# EAGLE design RP2040_Thing_Plus (EAGLE 9.4.2)
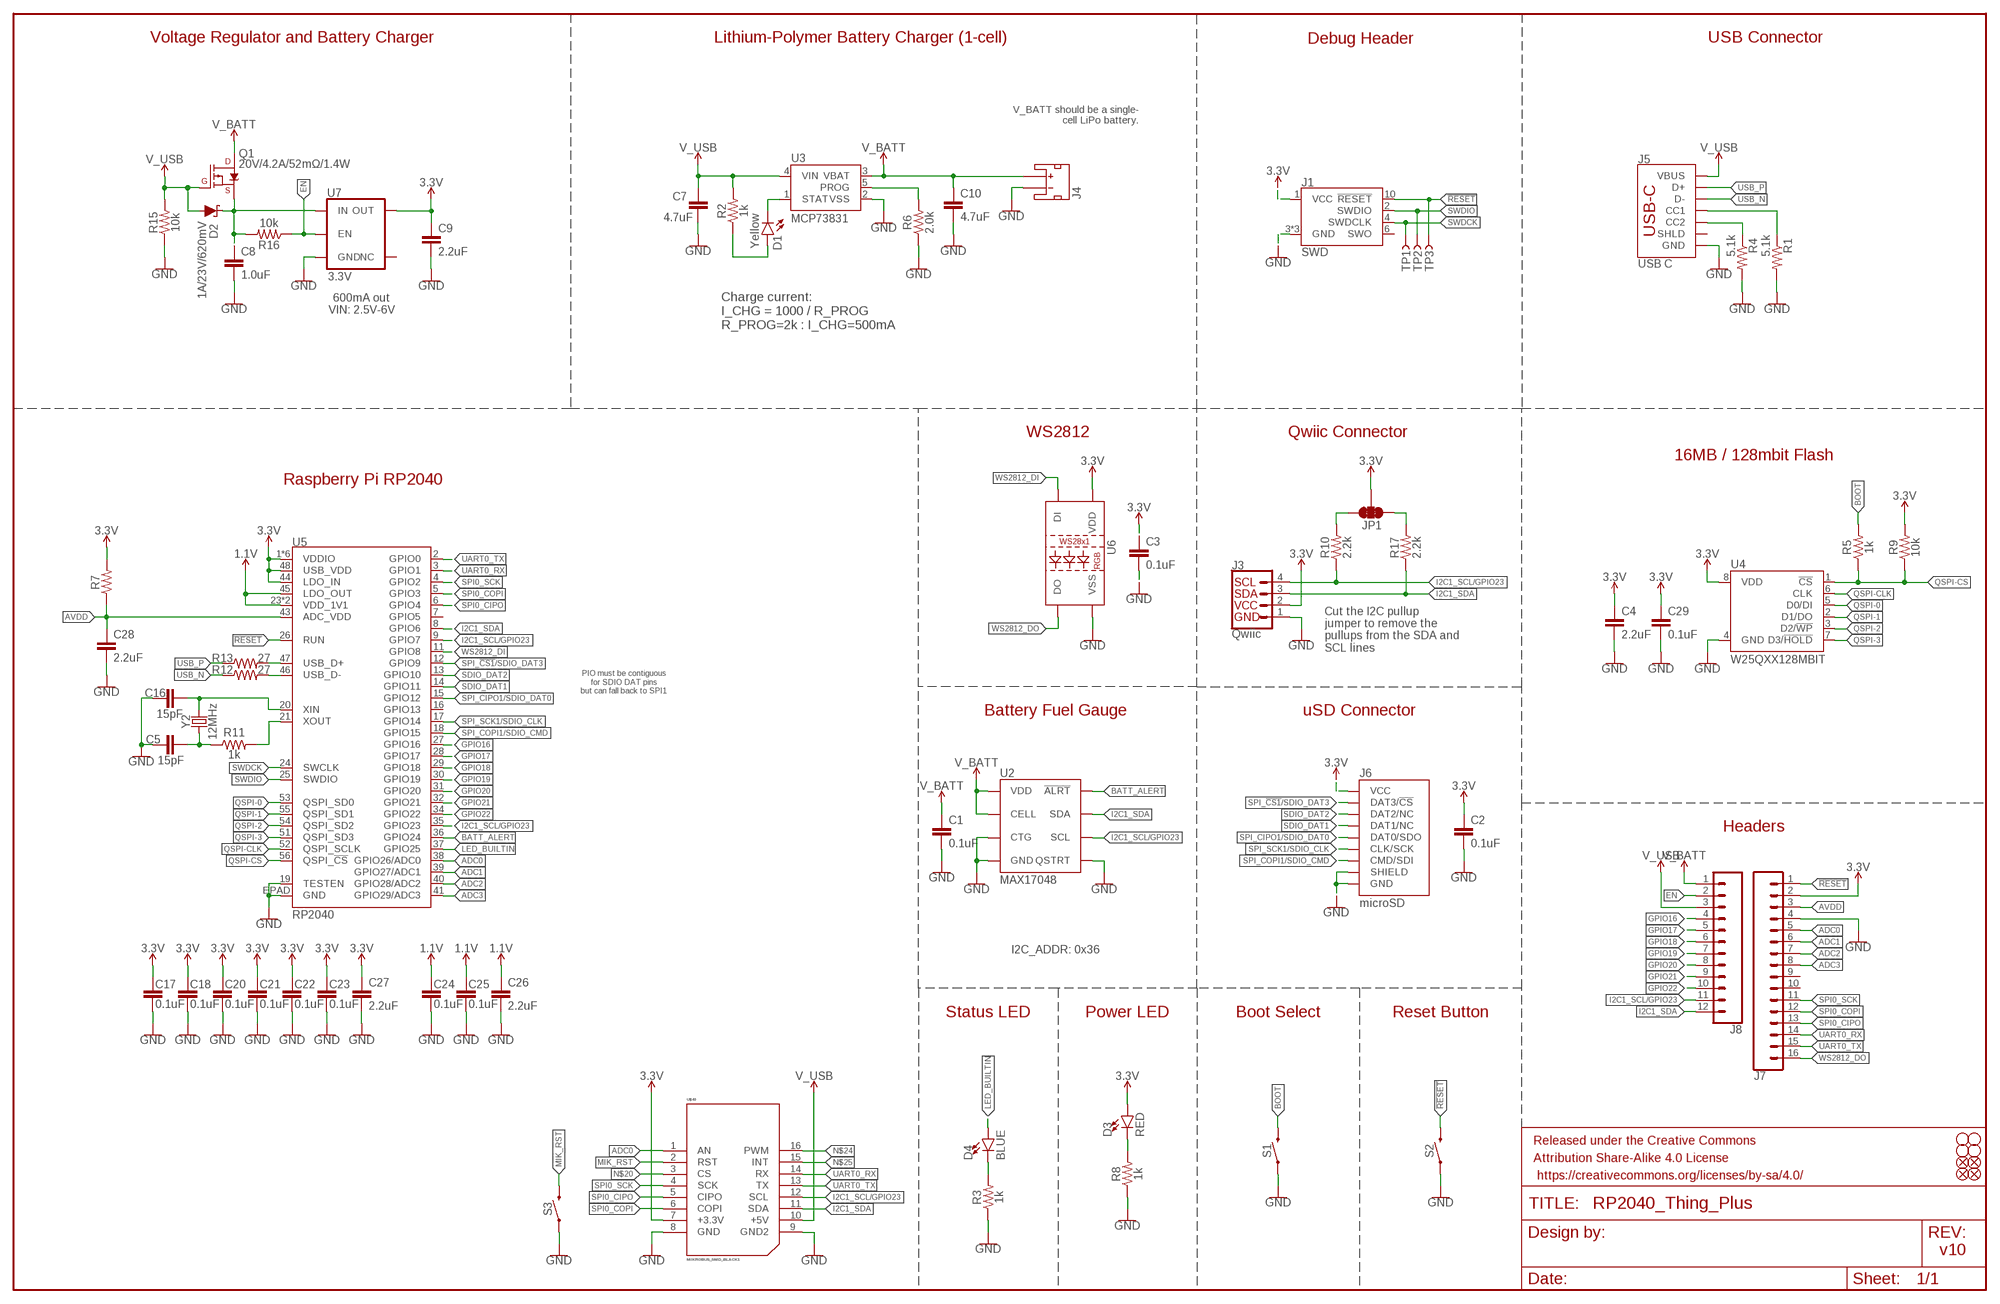
[diagram p0: schematic, sheet 1]

## Parts
C1  0.1uF  0.1UF-0402T-6.3V-10%-X7R  [0402-TIGHT]
C2  0.1uF  0.1UF-0402T-6.3V-10%-X7R  [0402-TIGHT]
C3  0.1uF  0.1UF-0402T-6.3V-10%-X7R  [0402-TIGHT]
C4  2.2uF  2.2UF-0402_TIGHT-10V-10%-X5R  [0402-TIGHT]
C5  15pF  15PF-0402T-50V-5%  [0402-TIGHT]
C7  4.7uF  4.7UF-0402_TIGHT-6.3V-20%-X5R  [0402-TIGHT]
C8  1.0uF  1.0UF-0402T-16V-10%  [0402-TIGHT]
C9  2.2uF  2.2UF-0402_TIGHT-10V-10%-X5R  [0402-TIGHT]
C10  4.7uF  4.7UF-0402_TIGHT-6.3V-20%-X5R  [0402-TIGHT]
C16  15pF  15PF-0402T-50V-5%  [0402-TIGHT]
C17  0.1uF  0.1UF-0402T-6.3V-10%-X7R  [0402-TIGHT]
C18  0.1uF  0.1UF-0402T-6.3V-10%-X7R  [0402-TIGHT]
C20  0.1uF  0.1UF-0402T-6.3V-10%-X7R  [0402-TIGHT]
C21  0.1uF  0.1UF-0402T-6.3V-10%-X7R  [0402-TIGHT]
C22  0.1uF  0.1UF-0402T-6.3V-10%-X7R  [0402-TIGHT]
C23  0.1uF  0.1UF-0402T-6.3V-10%-X7R  [0402-TIGHT]
C24  0.1uF  0.1UF-0402T-6.3V-10%-X7R  [0402-TIGHT]
C25  0.1uF  0.1UF-0402T-6.3V-10%-X7R  [0402-TIGHT]
C26  2.2uF  2.2UF-0402_TIGHT-10V-10%-X5R  [0402-TIGHT]
C27  2.2uF  2.2UF-0402_TIGHT-10V-10%-X5R  [0402-TIGHT]
C28  2.2uF  2.2UF-0402_TIGHT-10V-10%-X5R  [0402-TIGHT]
C29  0.1uF  0.1UF-0402T-6.3V-10%-X7R  [0402-TIGHT]
D1  Yellow  LED-YELLOW0603  [LED-0603]
D2  1A/23V/620mV  DIODE-SCHOTTKY-BAT20J  [SOD-323]
D3  RED  LED-RED0603  [LED-0603]
D4  BLUE  LED-BLUE0603  [LED-0603]
FD1  FIDUCIALUFIDUCIAL  [FIDUCIAL-MICRO]
FD2  FIDUCIALUFIDUCIAL  [FIDUCIAL-MICRO]
FD3  FIDUCIALUFIDUCIAL  [FIDUCIAL-MICRO]
FD4  FIDUCIALUFIDUCIAL  [FIDUCIAL-MICRO]
FRAME1  FRAME-LEDGER  [CREATIVE_COMMONS]
H1  STAND-OFF  [STAND-OFF]
H2  STAND-OFF  [STAND-OFF]
H3  STAND-OFF  [STAND-OFF]
H4  STAND-OFF  [STAND-OFF]
J1  SWD  CORTEX_JTAG_DEBUG_MINIMUM_PTH  [2X5-PTH-1.27MM]
J3  Qwiic  QWIIC_CONNECTORJS-1MM  [JST04_1MM_RA]
J4  JST_2MM_MALE  [JST-2-SMD]
J5  USB C  USB_C_4-LAYER-ISOLATED  [USB-C-16P-4LAYER-ISOLATED]
J6  microSD  MICRO-SD-SDIOPUSH-PUSH  [MICRO-SD-SOCKET]
J7  CONN_161X16_NO_SILK  [1X16_NO_SILK]
J8  CONN_12NO_SILK  [1X12_NO_SILK]
JP1  JUMPER-SMT_3_2-NC_TRACE_SILK  [SMT-JUMPER_3_2-NC_TRACE_SILK]
Q1  20V/4.2A/52mΩ/1.4W  MOSFET_PCH-DMG2305UX-7  [SOT23-3]
R1  5.1k  5.1KOHM-0402T-1/16W-1%  [0402-TIGHT]
R2  1k  1KOHM-0402T-1/16W-1%  [0402-TIGHT]
R3  1k  1KOHM-0402T-1/16W-1%  [0402-TIGHT]
R4  5.1k  5.1KOHM-0402T-1/16W-1%  [0402-TIGHT]
R5  1k  1KOHM-0402T-1/16W-1%  [0402-TIGHT]
R6  2.0k  2.0KOHM-0603-1/10W-5%  [0603]
R7  200OHM-0402T-1/16W-1%  [0402-TIGHT]
R8  1k  1KOHM-0402T-1/16W-1%  [0402-TIGHT]
R9  10k  10KOHM-0402T-1/16W-1%  [0402-TIGHT]
R10  2.2k  2.2KOHM-0402T-1/16W-1%  [0402-TIGHT]
R11  1k  1KOHM-0402T-1/16W-1%  [0402-TIGHT]
R12  27  27OHM  [0402-TIGHT]
R13  27  27OHM  [0402-TIGHT]
R15  10k  10KOHM-0402T-1/16W-1%  [0402-TIGHT]
R16  10k  10KOHM-0402T-1/16W-1%  [0402-TIGHT]
R17  2.2k  2.2KOHM-0402T-1/16W-1%  [0402-TIGHT]
S1  MOMENTARY-SWITCH-SPST-SMD-5.2MM-TALL  [TACTILE_SWITCH_SMD_5.2MM]
S2  MOMENTARY-SWITCH-SPST-SMD-5.2MM-TALL  [TACTILE_SWITCH_SMD_5.2MM]
S3  MOMENTARY-SWITCH-SPST-SMD-5.2MM-TALL  [TACTILE_SWITCH_SMD_5.2MM]
TP1  TEST-POINT3X4  [PAD.03X.04]
TP2  TEST-POINT3X4  [PAD.03X.04]
TP3  TEST-POINT3X4  [PAD.03X.04]
U2  MAX17048  MAX17048DFN8  [DFN-8]
U3  MCP73831  [SOT23-5]
U4  W25QXX128MBIT  W25QXX128MBIT-6X5-SKINNY_CENTER  [WSON-8-6X5-SKINNY_CENTERPAD]
U5  RP2040  [QFN-56]
U6  WS2812-2020  [WS2812-2020]
U7  3.3V  V_REG_AP2112K-3.3V  [SOT23-5]
U$43  MIKROBUS_SMD_BLACK1  [MIKROBUS_SMD_BLACK]
Y2  12MHz  CRYSTAL-12MHZ  [CRYSTAL-SMD-2X2.5MM]

## Nets
1.1V: C24.1 C25.1 C26.1 U5.23(VDD_1V1) U5.45(LDO_OUT) U5.50(VDD_1V1)
3.3V: C2.1 C3.1 C4.1 C9.1 C17.1 C18.1 C20.1 C21.1 C22.1 C23.1 C27.1 C29.1 D3.A J1.1(VCC) J3.2 J6.VCC J7.2 JP1.2 R7.2 R9.2 U4.8(VDD) U5.1(VDDIO) U5.10(VDDIO) U5.22(VDDIO) U5.33(VDDIO) U5.42(VDDIO) U5.44(LDO_IN) U5.48(USB_VDD) U5.49(VDDIO) U6.4(VDD) U7.5(OUT) U$43.7(+3.3V)
!RESET!: J1.10(!RESET) J7.1 S2.3 TP3.P$1 U5.26(RUN)
ADC0: J7.5 U5.38(GPIO26/ADC0) U$43.1(AN)
ADC1: J7.6 U5.39(GPIO27/ADC1)
ADC2: J7.7 U5.40(GPIO28/ADC2)
ADC3: J7.8 U5.41(GPIO29/ADC3)
AVDD: C28.1 J7.3 R7.1 U5.43(ADC_VDD)
BATT_ALERT: U2.5(!ALRT) U5.36(GPIO24)
BOOT: R5.2 S1.3
EN: J8.2 R16.1 U7.3(EN)
GND: C1.2 C2.2 C3.2 C4.2 C5.1 C7.2 C8.2 C9.2 C10.2 C16.1 C17.2 C18.2 C20.2 C21.2 C22.2 C23.2 C24.2 C25.2 C26.2 C27.2 C28.2 C29.2 J1.3(GND) J1.5(GND) J1.9(GND) J3.1 J4.1(-) J5.GND J5.GND2(GND) J6.CD1(SHIELD) J6.GND J6.GND1(GND) J6.GND3(GND) J7.4 R1.2 R3.1 R4.2 R6.1 R8.1 R15.1 S1.1 S2.1 S3.1 U2.1(CTG) U2.4(GND) U2.6(QSTRT) U2.9(GND) U3.2(VSS) U4.4(GND) U5.19(TESTEN) U5.EPAD(GND) U6.2(VSS) U7.2(GND) U$43.8(GND) U$43.9(GND2)
GPIO16: J8.4 U5.27(GPIO16)
GPIO17: J8.5 U5.28(GPIO17)
GPIO18: J8.6 U5.29(GPIO18)
GPIO19: J8.7 U5.30(GPIO19)
GPIO20: J8.8 U5.31(GPIO20)
GPIO21: J8.9 U5.32(GPIO21)
GPIO22: J8.10 U5.34(GPIO22)
I2C1_SCL/GPIO23: J3.4 J8.11 R10.1 U2.7(SCL) U5.9(GPIO7) U5.35(GPIO23) U$43.12(SCL)
I2C1_SDA: J3.3 J8.12 R17.1 U2.8(SDA) U5.8(GPIO6) U$43.11(SDA)
LED_BUILTIN: D4.A U5.37(GPIO25)
MIK_RST: S3.3 U$43.2(RST)
N$1: D4.C R3.2
N$2: JP1.3 R10.2
N$3: JP1.1 R17.2
N$4: R11.2 U5.21(XOUT)
N$5: C16.2 U5.20(XIN) Y2.P3
N$6: C5.2 R11.1 Y2.P1
N$7: D3.C R8.2
N$9: D1.C U3.1(STAT)
N$11: J5.A5(CC1) R1.1
N$12: J5.B5(CC2) R4.1
N$14: R6.2 U3.5(PROG)
N$15: C8.1 D2.C Q1.2(S) R16.2 U7.1(IN)
N$17: D1.A R2.1
N$20: U$43.3(CS)
N$24: U$43.16(PWM)
N$25: U$43.15(INT)
QSPI-0: U4.5(D0/DI) U5.53(QSPI_SD0)
QSPI-1: U4.2(D1/DO) U5.55(QSPI_SD1)
QSPI-2: U4.3(D2/!WP!) U5.54(QSPI_SD2)
QSPI-3: U4.7(D3/!HOLD!) U5.51(QSPI_SD3)
QSPI-CLK [Clock]: U4.6(CLK) U5.52(QSPI_SCLK)
QSPI-CS: R5.1 R9.1 U4.1(!CS!) U5.56(QSPI_!CS!)
SDIO_DAT1: J6.DAT1(DAT1/NC) U5.14(GPIO11)
SDIO_DAT2: J6.DAT2(DAT2/NC) U5.13(GPIO10)
SPI0_CIPO: J7.13 U5.6(GPIO4) U$43.5(CIPO)
SPI0_COPI: J7.12 U5.5(GPIO3) U$43.6(COPI)
SPI0_SCK: J7.11 U5.4(GPIO2) U$43.4(SCK)
SPI_!CS1!/SDIO_DAT3: J6.CS/DAT3(DAT3/!CS!) U5.12(GPIO9)
SPI_CIPO1/SDIO_DAT0: J6.DO/DAT0(DAT0/SDO) U5.15(GPIO12)
SPI_COPI1/SDIO_CMD: J6.DI/CMD(CMD/SDI) U5.18(GPIO15)
SPI_SCK1/SDIO_CLK: J6.SCLK(CLK/SCK) U5.17(GPIO14)
SWDCK: J1.4(SWDCLK) TP1.P$1 U5.24(SWCLK)
SWDIO: J1.2(SWDIO) TP2.P$1 U5.25(SWDIO)
UART0_RX: J7.14 U5.3(GPIO1) U$43.14(RX)
UART0_TX: J7.15 U5.2(GPIO0) U$43.13(TX)
USB_F_N: R12.2 U5.46(USB_D-)
USB_F_P: R13.2 U5.47(USB_D+)
USB_N: J5.A7(D-) J5.B7(D-) R12.1
USB_P: J5.A6(D+) J5.B6(D+) R13.1
V_BATT: C1.1 C10.1 J4.2(+) J8.1 Q1.3(D) U2.2(CELL) U2.3(VDD) U3.3(VBAT)
V_USB: C7.1 D2.A J5.VBUS1(VBUS) J5.VBUS2(VBUS) J8.3 Q1.1(G) R2.2 R15.2 U3.4(VIN) U$43.10(+5V)
WS2812_DI: U5.11(GPIO8) U6.3(DI)
WS2812_DO: J7.16 U6.1(DO)
Unconnected: J1.6(SWO) J4.NC1(PAD1) J4.NC2(PAD2) J5.SHLD1(SHLD) J5.SHLD2(SHLD) J5.SHLD3(SHLD) J5.SHLD4(SHLD) J5.SHLD5(SHLD) J5.SHLD6(SHLD) J5.SHLD7(SHLD) J5.SHLD8(SHLD) J7.9 J7.10 U5.7(GPIO5) U5.16(GPIO13) U7.4(NC)

## Notes on the sheet
- Voltage Regulator and Battery Charger | Lithium-Polymer Battery Charger (1-cell) | Debug Header | USB Connector
- V_BATT should be a single-
  cell LiPo battery.
- Charge current:
  I_CHG = 1000 / R_PROG
  R_PROG=2k : I_CHG=500mA
- 600mA out
  VIN: 2.5V-6V
- WS2812 | Qwiic Connector
- 16MB / 128mbit Flash
- Raspberry Pi RP2040
- Cut the I2C pullup 
  jumper to remove the 
  pullups from the SDA and 
  SCL lines
- PIO must be contiguous
  for SDIO DAT pins
  but can fall back to SPI1
- Battery Fuel Gauge | uSD Connector
- Headers
- I2C_ADDR: 0x36
- Status LED | Power LED | Boot Select | Reset Button
- v10

## Library data of the parts
C1-C3 C17 C18 C20-C25 C29 = SparkFun-Capacitors:0.1UF: 0.1µF ceramic capacitors A capacitor is a passive two-terminal electrical component used to store electrical energy temporarily in an electric field.; PROD_ID: CAP-14993
C4 C9 C26-C28 = SparkFun-Capacitors:2.2UF: 2.2µF ceramic capacitors A capacitor is a passive two-terminal electrical component used to store electrical energy temporarily in an electric field.; PROD_ID: CAP-14232
C5 C16 = SparkFun-Capacitors:15PF: 15pF ceramic capacitors A capacitor is a passive two-terminal electrical component used to store electrical energy temporarily in an electric field.; PROD_ID: CAP-13063
C7 C10 = SparkFun-Capacitors:4.7UF: 4.7µF ceramic capacitors A capacitor is a passive two-terminal electrical component used to store electrical energy temporarily in an electric field.; PROD_ID: CAP-14240
C8 = SparkFun-Capacitors:1.0UF: 1µF ceramic capacitors A capacitor is a passive two-terminal electrical component used to store electrical energy temporarily in an electric field.; PROD_ID: CAP-12417
D1 = SparkFun-LED:LED-YELLOW: Yellow SMD LED Used in manufacturing several products at SparkFun. Packages: 0603 - SMD 0603 package[Product Link] <http://www.kingbrightusa.com/product.asp?catalog_name=LED&product_id=APT1608SYCK> 0603 -SMART - SMART SMD 0603 package (more efficient/more expensive) [Product Link] <http://www.osram-os.com/osram_os/en/products/product-catalog/led-light-emitting-diodes/smartled-0603/ly-l29k/index.jsp> LilyPad - SMD1206 package[Product Datasheet] <https://www.sparkfun.com/datasheets/DevTools/LilyPad/Q150YUS4.pdf> SparkFun Products: Blynk Board <https://www.sparkfun.com/products/13794> IOIO-OTG <https://www.sparkfun.com/products/13613> XBee Explorer Serial <https://www.sparkfun.com/products/13225>; PROD_ID: DIO-09003
D2 = SparkFun-DiscreteSemi:DIODE-SCHOTTKY: Schottky diode A Schottky diode is a semiconductor diode which has a low forward voltage drop and a very fast switching action.; PROD_ID: DIO-11623
D3 = SparkFun-LED:LED-RED: Red SMD LED Used in manufacturing of most products at SparkFun Packages: 0603 - SMD 0603 package [Product Link] <http://docs.avagotech.com/docs/AV02-0551EN> 0603 SMART - SMD 0603 SMART package ( more efficient and expensive)[Product Link] <http://www.osram-os.com/Graphics/XPic2/00077099_0.pdf> 1206 - SMD1206 package [Product Link] <https://www.sparkfun.com/datasheets/DevTools/LilyPad/Q150OVS4.pdff> SparkFun Products: Pro Mini 328 -5V <https://www.sparkfun.com/products/821> RedBoard <https://www.sparkfun.com/products/12757> IOIO-OTG <https://www.sparkfun.com/products/13613>; PROD_ID: DIO-00819
D4 = SparkFun-LED:LED-BLUE: Blue SMD LED Used in manufacturing of various products at SparkFun Packages: 0603 - SMD 0603 package [Product Link] <http://www.digikey.com/product-detail/en/SMLE12BC7TT86/511-1589-2-ND/1641808> 1206 - SMD1206 package [Product Link] <http://www.digikey.com/product-detail/en/lite-on-inc/LTST-C150TBKT/160-1643-1-ND/573584> SparkFun Products: ESP8266 Thing-Dev Board <https://www.sparkfun.com/products/13711> RedBoard <https://www.sparkfun.com/products/12757>; PROD_ID: DIO-08575
FD1-FD4 = SparkFun-Aesthetics:FIDUCIAL: Fiducial Alignment Points Point-of-reference for pick-and-place machines and other optical instruments.
FRAME1 = SparkFun-Aesthetics:FRAME-LEDGER: Schematic Frame - Ledger Standard 11x14 US Ledger frame
H1-H4 = SparkFun-Hardware:STAND-OFF: Stand Off Drill holes for mechanically mounting via screws, standoffs, etc. Note: Use the keepout ring to avoid running the screw head into surrounding components. Variant Overviews STAND-OFF - Mechanical footprint for a #4 phillips button head screw. STAND-OFF-TIGHT - Mechanical footprint for a #4 phillips button head screw, Example SparkFun Products Screw - Phillips Head (1/4", 4-40, 10 pack) <https://www.sparkfun.com/products/10453> (PRT-10453) Screw - Phillips Head (1/2", 4-40, 10 pack) <https://www.sparkfun.com/products/10452> (PRT-10452) Screw - Phillips Head (3/4", 4-40, 10 pack) <https://www.sparkfun.com/products/10451> (PRT-10451) Screw - Phillips Head (1", 4-40, 10 pack) <https://www.sparkfun.com/products/10450> (PRT-10450)
J1 = SparkFun-Connectors:CORTEX_JTAG_DEBUG_MINIMUM: Cortex Debug Connector - 10 pin Supports JTAG debug, Serial Wire debug, and Serial Wire Viewer. PTH and SMD connector options available. General Connector Information <http://infocenter.arm.com/help/topic/com.arm.doc.faqs/attached/13634/cortex_debug_connectors.pdf> Products: PTH Connector <http://www.digikey.com/product-detail/en/cnc-tech/3220-10-0100-00/1175-1627-ND/3883661> -via Digi-Key SparkFun PSoc <https://www.sparkfun.com/products/13229> SparkFun T <https://www.sparkfun.com/products/13810>
J3 = SparkFun-Connectors:QWIIC_CONNECTOR: SparkFun I2C Standard Qwiic Connector An SMD 1mm pitch JST connector makes it easy and quick (get it? Qwiic?) to connect I2C devices to each other. The Qwiic system <http://www.sparkfun.com/qwiic> enables fast and solderless connection between popular platforms and various sensors and actuators. We carry 200mm <https://www.sparkfun.com/products/14204>, 100mm <https://www.sparkfun.com/products/14205>, 50mm <https://www.sparkfun.com/products/14206>, and breadboard friendly <https://www.sparkfun.com/products/14207> Qwiic cables. We also offer 10 pcs strips <https://www.sparkfun.com/products/14323> the SMD connectors.; PROD_ID: CONN-13694; VALUE: QWIIC_RIGHT_ANGLE
J4 = SparkFun-Connectors:JST_2MM_MALE: JST 2MM MALE RA CONNECTOR Two pin, compact surface mount connector. Commonly used as a battery input connection point. We really like the solid locking feeling and high current rating on these small connectors. We use these all the time as battery connectors. Mates to single-cell LiPo batteries. Here is the connector we sell at SparkFun: JST Right Angle Connector - White <https://www.sparkfun.com/products/8612> (PRT-08612) Datasheet <http://www.sparkfun.com/datasheets/Prototyping/Connectors/JST-Horizontal.pdf> It was used on these SparkFun products: SparkFun MOSFET Power Controller <https://www.sparkfun.com/products/11214> (PRT-11214) SparkFun Battery Babysitter - LiPo Battery Manager <https://www.sparkfun.com/products/13777> (PRT-13777) And many, many others that required a lipo battery connection.; PROD_ID: CONN-11443; SF_ID: PRT-08612
J5 = SparkFun-Connectors:USB_C: USB Type C 16Pin Connector Super Speed pins not available on the 16-pin purely SMD connector so this part is best for USB 2.0 implementations. D1 and D2 are tied together enabling D+/- no matter which way the cable is plugged into the connector. The two channel configuration pins (CC1/2) are exposed. These are normally connected to ground via 5.1k resistors but can be reconfigured for high current/high power applications. **4-LAYER BOARD WARNING!!** If designing 4-layer board, make sure to select the variant _4-LAYER-ISOLATED. The linked footprint (USB-C-16-4LAYER-ISOLATED) includes some very necessary cutout polygons in the inner layers (2 and 15). This prevents the PTH mounting shield legs on the USB connector from electrically connecting any other polygons on the inner layers (usually VCC and GND).; PROD_ID: CONN-14122; VALUE: USB Female Type C Connector
J6 = SparkFun-Connectors:MICRO-SD-SDIO: microSD Socket for Transflash Push-push type µSD socket. tDoc lines correctly indicate media card edge positions when inserting (unlocked, locked, depressed). NOTE: CD1 and CD2 are connected internally, and the default detect state of the socket is detect pin to ground. SparkFun Products: WAV Trigger <https://www.sparkfun.com/products/13660> CAN-Bus Shield <https://www.sparkfun.com/products/13262> SparkFun Level Shifing microSD Breakout <https://www.sparkfun.com/products/13743>; PROD_ID: CONN-07820
J7 = SparkFun-Connectors:CONN_16: Multi connection point. Often used as Generic Header-pin footprint for 0.1 inch spaced/style header connections On any of the 0.1 inch spaced packages, you can populate with these: Break Away Headers - Straight <https://www.sparkfun.com/products/116> (PRT-00116) Break Away Male Headers - Right Angle <https://www.sparkfun.com/products/553> (PRT-00553) Female Headers <https://www.sparkfun.com/products/115> (PRT-00115) Break Away Headers - Machine Pin <https://www.sparkfun.com/products/117> (PRT-00117) Break Away Female Headers - Swiss Machine Pin <https://www.sparkfun.com/products/743> (PRT-00743) For SCREWTERMINALS and SPRING TERMINALS visit here: Screw Terimnals on SparkFun.com <https://www.sparkfun.com/search/results?term=Screw+Terminals> (5mm/3.5mm/2.54mm spacing) This device is also useful as a general connection point to wire up your design to another part of your project. Our various solder wires solder well into these plated through hole pads. Hook-Up Wire - Assortment (Stranded, 22 AWG) <https://www.sparkfun.com/products/11375> (PRT-11375) Hook-Up Wire - Assortment (Solid Core, 22 AWG) <https://www.sparkfun.com/products/11367> (PRT-11367) View the entire wire category on our website here <https://www.sparkfun.com/categories/141> Special notes: Molex polarized connector foot print use with SKU : PRT-08231 with associated crimp pins and housings. 1MM SMD Version SKU: PRT-10208 NOTES ON THE VARIANTS LOCK and LOCK_LONGPADS... This footprint was designed to help hold the alignment of a through-hole component (i.e. 6-pin header) while soldering it into place. You may notice that each hole has been shifted either up or down by 0.005 of an inch from it's more standard position (which is a perfectly straight line). This slight alteration caused the pins (the squares in the middle) to touch the edges of the holes. Because they are alternating, it causes a "brace" to hold the component in place. 0.005 has proven to be the perfect amount of "off-center" position when using our standard breakaway headers. Although looks a little odd when you look at the bare footprint, once you have a header in there, the alteration is very hard to notice. Also,if you push a header all the way into place, it is covered up entirely on the bottom side.
J8 = SparkFun-Connectors:CONN_12: Multi connection point. Often used as Generic Header-pin footprint for 0.1 inch spaced/style header connections On any of the 0.1 inch spaced packages, you can populate with these: Break Away Headers - Straight <https://www.sparkfun.com/products/116> (PRT-00116) Break Away Male Headers - Right Angle <https://www.sparkfun.com/products/553> (PRT-00553) Female Headers <https://www.sparkfun.com/products/115> (PRT-00115) Break Away Headers - Machine Pin <https://www.sparkfun.com/products/117> (PRT-00117) Break Away Female Headers - Swiss Machine Pin <https://www.sparkfun.com/products/743> (PRT-00743) For SCREWTERMINALS and SPRING TERMINALS visit here: Screw Terimnals on SparkFun.com <https://www.sparkfun.com/search/results?term=Screw+Terminals> (5mm/3.5mm/2.54mm spacing) This device is also useful as a general connection point to wire up your design to another part of your project. Our various solder wires solder well into these plated through hole pads. Hook-Up Wire - Assortment (Stranded, 22 AWG) <https://www.sparkfun.com/products/11375> (PRT-11375) Hook-Up Wire - Assortment (Solid Core, 22 AWG) <https://www.sparkfun.com/products/11367> (PRT-11367) View the entire wire category on our website here <https://www.sparkfun.com/categories/141> Special notes: Molex polarized connector foot print use with SKU : PRT-08231 with associated crimp pins and housings. 1MM SMD Version SKU: PRT-10208 NOTES ON THE VARIANTS LOCK and LOCK_LONGPADS... This footprint was designed to help hold the alignment of a through-hole component (i.e. 6-pin header) while soldering it into place. You may notice that each hole has been shifted either up or down by 0.005 of an inch from it's more standard position (which is a perfectly straight line). This slight alteration caused the pins (the squares in the middle) to touch the edges of the holes. Because they are alternating, it causes a "brace" to hold the component in place. 0.005 has proven to be the perfect amount of "off-center" position when using our standard breakaway headers. Although looks a little odd when you look at the bare footprint, once you have a header in there, the alteration is very hard to notice. Also,if you push a header all the way into place, it is covered up entirely on the bottom side.
JP1 = SparkFun-Jumpers:JUMPER-SMT_3_2-NC_TRACE: Normally closed trace jumper (2 of 2 connections) This jumper has a trace between all three pads so they are normally closed (NC). Use a razor knife to open the connection(s). For best results follow the IPC guidelines for cutting traces: Cutout at least 0.063 mm (0.005 in). Remove all loose material to clean up the cut area. Seal the cut with an approved epoxy. Reapply solder to reclose the connection(s).
Q1 = SparkFun-DiscreteSemi:MOSFET_PCH: P-channel MOSFETs Voltage controlled devices that allow control of high current outputs. SparkFun Products: SparkFun ESP32 Thing <https://www.sparkfun.com/products/13907> SparkFun ESP8266 Thing <https://www.sparkfun.com/products/13231> SparkFun Pi Servo HAT V2 <https://www.sparkfun.com/products/15316> DMG2305UX-7 (20V/4.2A/SOT23-3); PROD_ID: TRAN-14388
R1 R4 = SparkFun-Resistors:5.1KOHM; PROD_ID: RES-14340
R2 R3 R5 R8 R11 = SparkFun-Resistors:1KOHM: 1kΩ resistor A resistor is a passive two-terminal electrical component that implements electrical resistance as a circuit element. Resistors act to reduce current flow, and, at the same time, act to lower voltage levels within circuits. - Wikipedia; PROD_ID: RES-14342
R6 = SparkFun-Resistors:2.0KOHM: 2kΩ resistor A resistor is a passive two-terminal electrical component that implements electrical resistance as a circuit element. Resistors act to reduce current flow, and, at the same time, act to lower voltage levels within circuits. - Wikipedia; PROD_ID: RES-08296
R7 = SparkFun-Resistors:200OHM: 200Ω resistor A resistor is a passive two-terminal electrical component that implements electrical resistance as a circuit element. Resistors act to reduce current flow, and, at the same time, act to lower voltage levels within circuits. - Wikipedia; PROD_ID: RES-15550
R9 R15 R16 = SparkFun-Resistors:10KOHM: 10kΩ resistor A resistor is a passive two-terminal electrical component that implements electrical resistance as a circuit element. Resistors act to reduce current flow, and, at the same time, act to lower voltage levels within circuits. - Wikipedia; PROD_ID: RES-14241
R10 R17 = SparkFun-Resistors:2.2KOHM: 2.2kΩ resistor A resistor is a passive two-terminal electrical component that implements electrical resistance as a circuit element. Resistors act to reduce current flow, and, at the same time, act to lower voltage levels within circuits. - Wikipedia; PROD_ID: RES-14341
R12 R13 = SparkFun-Resistors:27OHM: 27Ω resistor A resistor is a passive two-terminal electrical component that implements electrical resistance as a circuit element. Resistors act to reduce current flow, and, at the same time, act to lower voltage levels within circuits. - Wikipedia; PROD_ID: RES-15238
S1-S3 = SparkFun-Switches:MOMENTARY-SWITCH-SPST: Momentary Switch (Pushbutton) - SPST Normally-open (NO) SPST momentary switches (buttons, pushbuttons). Variants PTH-12MM - 12mm square, through-hole Momentary Pushbutton Switch - 12mm Square <https://www.sparkfun.com/products/9190> (COM-09190) PTH-6.0MM, PTH-6.0MM-KIT - 6.0mm square, through-hole Mini Pushbutton Switch <https://www.sparkfun.com/products/97> (COM-00097) KIT package intended for soldering kit's - only one side of pads' copper is exposed. PTH-RIGHT-ANGLE-KIT - Right-angle, through-hole Right Angle Tactile Button <https://www.sparkfun.com/products/10791> - Used on SparkFun BigTime Watch Kit <https://www.sparkfun.com/products/11734> SMD-12MM - 12mm square, surface-mount Tactile Button - SMD (12mm) <https://www.sparkfun.com/products/12993> (COM-12993) Used on SparkFun PicoBoard <https://www.sparkfun.com/products/11888> SMD-4.5MM - 4.5mm Square Trackball Switch Used on SparkFun Blackberry Trackballer Breakout <https://www.sparkfun.com/products/13169> SMD-4.6MMX2.8MM - 4.60mm x 2.80mm, surface mount Used on SparkFun SAMD21 Mini Breakout <https://www.sparkfun.com/products/13664> SMD-5.2MM, SMD-5.2-REDUNDANT - 5.2mm square, surface-mount Mini Pushbutton Switch - SMD <https://www.sparkfun.com/products/8720> (COM-08720) Used on Arduino Pro Mini <https://www.sparkfun.com/products/11114> REDUNDANT package connects both switch circuits together SMD-6.0X3.5MM - 6.0 x 3.5mm, surface mount Momentary Reset Switch SMD <https://www.sparkfun.com/products/8229> (COM-08229) SMD-6.2MM-TALL - 6.2mm square, surface mount Tactile Button - SMD (6mm) <https://www.sparkfun.com/products/12992> Used on SparkFun Digital Sandbox <https://www.sparkfun.com/products/12651> SMD-RIGHT-ANGLE - Right-angle, surface mount Used on SparkFun Block for Intel® Edison - Arduino <https://www.sparkfun.com/products/13036>; PROD_ID: SWCH-14139
TP1-TP3 = SparkFun-Connectors:TEST-POINT: SparkFun Test Points Bare copper test points for troubleshooting or In-Circuit-Testing. These are used by our Production team for verifying production board runs using pogo-pins on test beds. SparkFun Products: SparkFun LSM9DS1 Breakout <https://www.sparkfun.com/products/13284> SparkFun PSOC <https://www.sparkfun.com/products/13714> SparkFun Load Cell Amplifier <https://www.sparkfun.com/products/13879>
U2 = SparkFun-IC-Power:MAX17048: Micropower 1-Cell Li+ ModelGauge SparkFun Products Qduino Mini <https://www.sparkfun.com/products/13614> (DEV-13614); PROD_ID: IC-12551
U3 = SparkFun-IC-Power:MCP73831: MCP73831T Li-Ion, Li-Pol Controller Miniature single cell, fully integrated Li-Ion, Li-polymer charge management controller Datasheet <http://ww1.microchip.com/downloads/en/DeviceDoc/20001984g.pdf> SparkFun Products: SparkFun ESP32 Thing <https://www.sparkfun.com/products/13907> SparkFun 9DoF Razor IMU M0 <https://www.sparkfun.com/products/14001>; PROD_ID: IC-09995
U4 = SparkFun-IC-Memory:W25QXX; PROD_ID: IC-15107
U5 = RP2040:RP2040: Raspberry Pi RP2040 MCU 56-pin 32-bit Microcontroller with 264kB of SRAM and external flash support up to 16MB Getting Started with the RP2040 <https://pico.raspberrypi.org/getting-started/> Dual-core ARM Cortex M0+ processor, flexible clock running up to 133 MHz 264kB of SRAM, and QSPI control of common flash memory USB 1.1 Host and Device support Low-power sleep and dormant modes Drag & drop programming using mass storage over USB 26 multi-function GPIO pins 2×SPI, 2×I2C, 2×UART, 3×12-bit ADC, 16×controllable PWM channels Accurate clock and timer on-chip Temperature sensor Accelerated floating point libraries on-chip 8×Programmable IO (PIO) state machines for custom peripheral support; PROD_ID: IC-15502
U6 = SparkFun-LED:WS2812-2020
U7 = SparkFun-IC-Power:V_REG_AP2112: AP2112 - 600mA CMOS LDO Regulator w/ Enable The AP2112 is CMOS process low dropout linear regulator with enable function, the regulator delivers a guaranteed 600mA (min.) continuous load current. Features Output Voltage Accuracy: ±1.5% Output Current: 600mA (Min.) Foldback Short Current Protection: 50mA Enable Function to Turn ON/OFF VOUT Low Dropout Voltage (3.3V): 250mV (Typ.) @IOUT=600mA Excellent Load Regulation: 0.2%/A (Typ.) Excellent Line Regulation: 0.02%/V (Typ.) Low Quiescent Current: 55μA (Typ.) Low Standby Current: 0.01μA (Typ.) Low Output Noise: 50μVRMS PSRR: 100Hz -65dB, 1kHz -65dB OTSD Protection Stable with 1.0μF Flexible Cap: Ceramic, Tantalum and Aluminum Electrolytic Operation Temperature Range: -40°C to 85°C ESD: MM 400V, HBM 4000V; PROD_ID: VREG-12457
U$43 = mikroBUS_SMD_BLACK:MIKROBUS_SMD_BLACK; PROD_ID: CONN-16267
Y2 = SparkFun-Clocks:CRYSTAL-12MHZ: 12.0MHz Crystal Frequency: 12.0MHz Frequency Tolerance: ±20ppm Load Capacitance: 18pF SparkFun Products: SparkFun Logomatic <https://www.sparkfun.com/products/12772> Pocket AVR Programmer <https://www.sparkfun.com/products/9825>; PROD_ID: XTAL-15540

## Net classes
0 default: width 0 mm, drill 0 mm
2 Clock: width 0.089 mm, clearance 0.178 mm

## Board
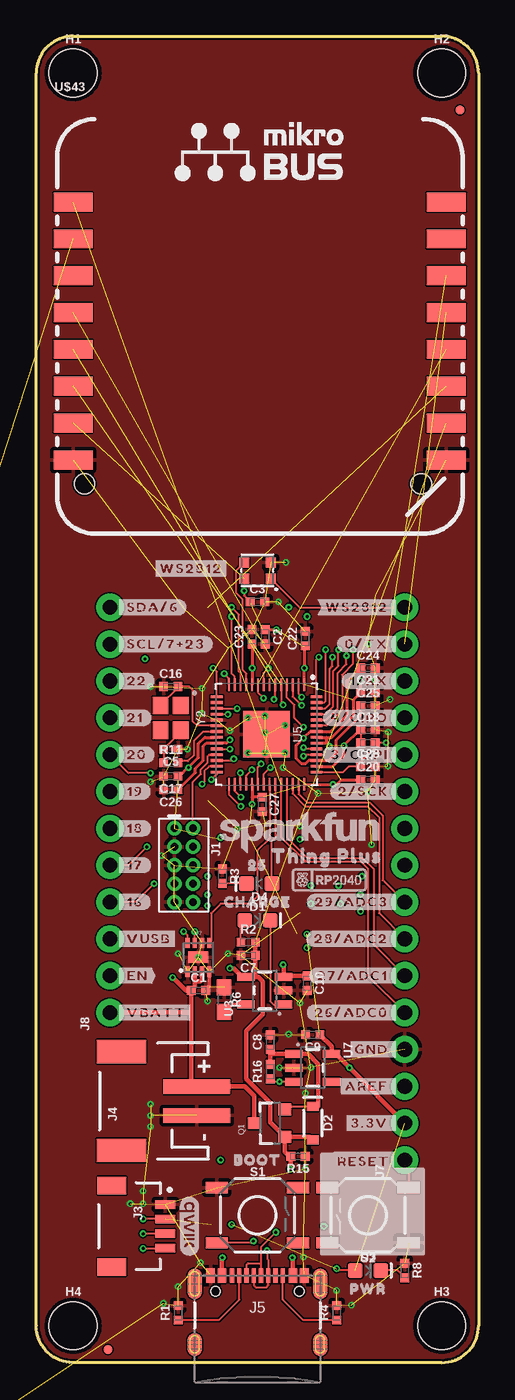
[diagram p1: board, top side]
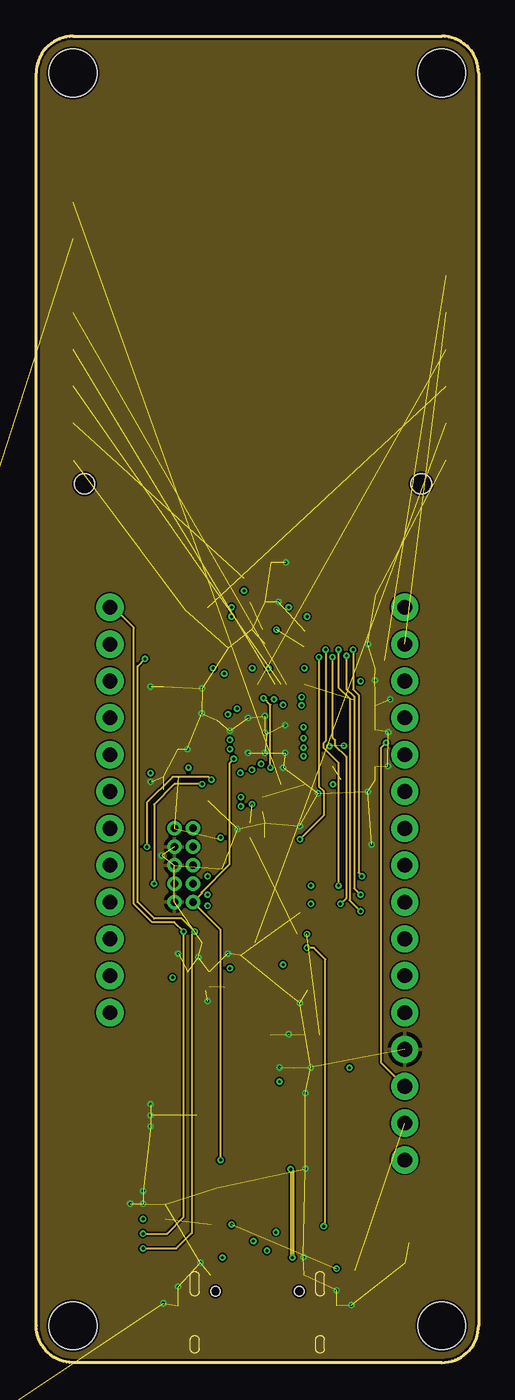
[diagram p2: board, inner layer gndvert]
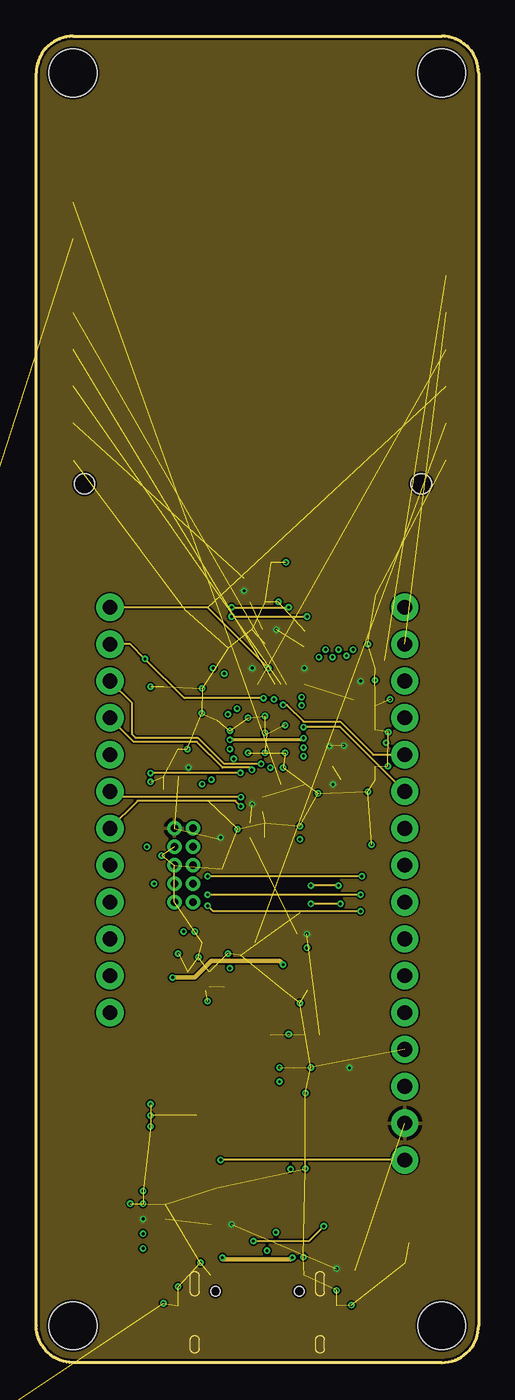
[diagram p3: board, inner layer pwrhorz]
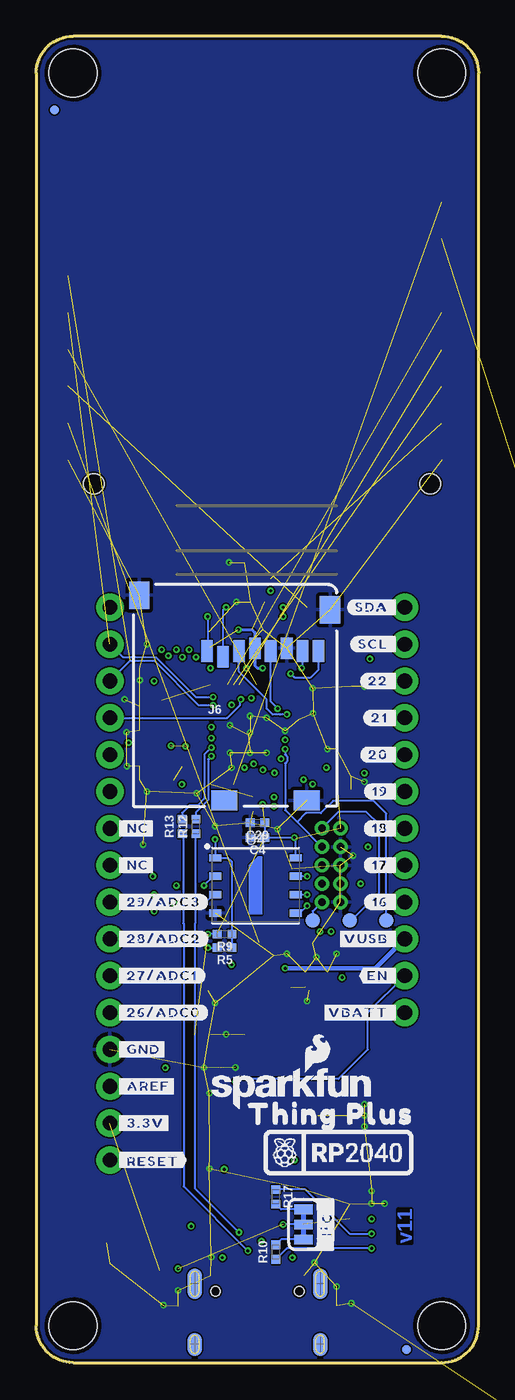
[diagram p4: board, bottom side, seen from below]

Size 30.48 x 91.44 mm. Coordinates in mm from the lower left corner, seen from the top.
Outline: 2.54,91.44 27.94,91.44 arc-90 30.48,88.9 30.48,2.54 arc-90 27.94,0 2.54,0 arc-90 0,2.54 0,88.9 arc-90 2.54,91.44
Copper layers (1+2*15+16): Top 0.035mm / dielectric 1.5mm / gndvert 0.035mm / dielectric 0.15mm / pwrhorz 0.035mm / dielectric 0.2mm / Bottom 0.035mm
Design rules "SparkFun-4-Layer-MicroMod-JLCPCB": minimum track width 4mil, minimum drill 0.2mm, track to track 4mil, track to pad 4mil, pad to pad 4mil, via to via 4mil, smd to smd 4mil, copper to edge 6mil, drill to drill 6mil, minimum pad ring 3mil, minimum via ring 3mil, stop-mask expansion 4mil, vias tented up to drill 25mil, thermal gap 10mil

### Footprints (pad centres in the part's own frame; a part is rotated, then mirrored left to right if it is on the bottom)
0402-TIGHT = smd 0.6 x 0.6: 1 -0.5,0; 2 0.5,0
LED-0603 = smd 1 x 1: A -0.877,0; C 0.877,0
SOD-323 = smd 0.63 x 0.83: A 1.15,0; C -1.15,0
FIDUCIAL-MICRO = smd 0.635 x 0.635: 1 0,0
STAND-OFF = hole 3.302: 0,0
2X5-PTH-1.27MM = drill 0.508 pad 1: 1 -2.54,-0.635; 2 -2.54,0.635; 3 -1.27,-0.635; 4 -1.27,0.635; 5 0,-0.635; 6 0,0.635; 7 1.27,-0.635; 8 1.27,0.635; 9 2.54,-0.635; 10 2.54,0.635
JST04_1MM_RA = smd 0.6 x 1.35: 1 -1.5,0; 2 -0.5,0; 3 0.5,0; 4 1.5,0 | smd 1.2 x 2: NC1 2.8,-3.675; NC2 -2.8,-3.675
JST-2-SMD = smd 1 x 4.6: 1 -1,-3.7; 2 1,-3.7 | smd 1.6 x 3.4: NC1 -3.4,1.5; NC2 3.4,1.5
USB-C-16P-4LAYER-ISOLATED = smd 0.3 x 1: A5 -1.25,-0.34; A6 -0.25,-0.34; A7 0.25,-0.34; A8 1.25,-0.34; B5 1.75,-0.34; B6 0.75,-0.34; B7 -0.75,-0.34; B8 -1.75,-0.34 | smd 0.6 x 1: GND -3.225,-0.34; GND2 3.225,-0.34; VBUS1 -2.45,-0.34; VBUS2 2.45,-0.34 | smd 1 x 2.1: SHLD1 -4.32,-0.915; SHLD2 4.32,-0.915 | smd 1 x 2.1 bottom: SHLD3 -4.32,-0.915; SHLD4 4.32,-0.915 | smd 1 x 1.6: SHLD5 -4.32,-5.095; SHLD8 4.32,-5.095 | smd 1 x 1.6 bottom: SHLD6 -4.32,-5.095; SHLD7 4.32,-5.095 | hole 0.65: -2.89,-1.445; 2.89,-1.445
MICRO-SD-SOCKET = smd 1.8 x 1.4: CD1 -2.05,0.4; CD2 -7.75,0.4 | smd 0.8 x 1.5: CS/DAT3 -7.84,10.3; DAT1 -1.24,10.7; DAT2 -8.94,10.7; DI/CMD -6.74,10.7; DO/DAT0 -2.34,10.7; GND -3.44,10.9; SCLK -4.54,10.7; VCC -5.64,10.9 | smd 1.4 x 1.9: GND1 -13.6,14.55; GND3 -0.45,13.55
1X16_NO_SILK = drill 1.016 pad 1.88: 1 0,0; 2 2.54,0; 3 5.08,0; 4 7.62,0; 5 10.16,0; 6 12.7,0; 7 15.24,0; 8 17.78,0; 9 20.32,0; 10 22.86,0; 11 25.4,0; 12 27.94,0; 13 30.48,0; 14 33.02,0; 15 35.56,0; 16 38.1,0
1X12_NO_SILK = drill 1.016 pad 1.88: 1 0,0; 2 2.54,0; 3 5.08,0; 4 7.62,0; 5 10.16,0; 6 12.7,0; 7 15.24,0; 8 17.78,0; 9 20.32,0; 10 22.86,0; 11 25.4,0; 12 27.94,0
SMT-JUMPER_3_2-NC_TRACE_SILK = smd 0.66 x 1.27: 1 -1.041,0; 2 0,0; 3 1.041,0
SOT23-3 = smd 0.8 x 0.9: 1 -0.95,-1; 2 0.95,-1; 3 0,1.1
0603 = smd 1.1 x 1: 1 -0.85,0; 2 0.85,0
TACTILE_SWITCH_SMD_5.2MM = smd 1.524 x 0.762: 1 -2.794,1.905; 2 2.794,1.905; 3 -2.794,-1.905; 4 2.794,-1.905
PAD.03X.04 = smd 1.016 x 1.016: P$1 0,0
DFN-8 = smd 0.3 x 0.7: 1 -0.75,-0.99; 2 -0.25,-0.99; 3 0.25,-0.99; 4 0.75,-0.99; 5 0.75,0.99; 6 0.25,0.99; 7 -0.25,0.99; 8 -0.75,0.99 | smd 1.38 x 0.8: 9 0,0
SOT23-5 = smd 0.55 x 1.2: 1 -0.95,-1.3; 2 0,-1.3; 3 0.95,-1.3; 4 0.95,1.3; 5 -0.95,1.3
WSON-8-6X5-SKINNY_CENTERPAD = smd 0.85 x 0.5: 1 -2.775,1.905; 2 -2.775,0.635; 3 -2.775,-0.635; 4 -2.775,-1.905; 5 2.775,-1.905; 6 2.775,-0.635; 7 2.775,0.635; 8 2.775,1.905
QFN-56 = smd 0.875 x 0.2: 1 -3.437,2.6; 2 -3.437,2.2; 3 -3.437,1.8; 4 -3.437,1.4; 5 -3.437,1; 6 -3.437,0.6; 7 -3.437,0.2; 8 -3.437,-0.2; 9 -3.437,-0.6; 10 -3.437,-1; 11 -3.437,-1.4; 12 -3.437,-1.8; 13 -3.437,-2.2; 14 -3.437,-2.6; 29 3.437,-2.6; 30 3.437,-2.2; 31 3.437,-1.8; 32 3.437,-1.4; 33 3.437,-1; 34 3.437,-0.6; 35 3.437,-0.2; 36 3.437,0.2; 37 3.437,0.6; 38 3.437,1; 39 3.437,1.4; 40 3.437,1.8; 41 3.437,2.2; 42 3.437,2.6 | smd 0.2 x 0.875: 15 -2.6,-3.437; 16 -2.2,-3.437; 17 -1.8,-3.437; 18 -1.4,-3.437; 19 -1,-3.437; 20 -0.6,-3.437; 21 -0.2,-3.437; 22 0.2,-3.437; 23 0.6,-3.437; 24 1,-3.437; 25 1.4,-3.437; 26 1.8,-3.437; 27 2.2,-3.437; 28 2.6,-3.437; 43 2.6,3.437; 44 2.2,3.437; 45 1.8,3.437; 46 1.4,3.437; 47 1,3.437; 48 0.6,3.437; 49 0.2,3.437; 50 -0.2,3.437; 51 -0.6,3.437; 52 -1,3.437; 53 -1.4,3.437; 54 -1.8,3.437; 55 -2.2,3.437; 56 -2.6,3.437 | smd 3.2 x 3.2: EPAD 0,0
WS2812-2020 = smd 0.7 x 0.7: 1 0.915,-0.55; 2 0.915,0.55; 3 -0.915,0.55; 4 -0.915,-0.55
MIKROBUS_SMD_BLACK = smd 2.7 x 1.3: 1 -12.7,8.89; 2 -12.7,6.35; 3 -12.7,3.81; 4 -12.7,1.27; 5 -12.7,-1.27; 6 -12.7,-3.81; 7 -12.7,-6.35; 8 -12.7,-8.89; 9 13.02,-8.89; 10 13.02,-6.35; 11 13.02,-3.81; 12 13.02,-1.27; 13 13.02,1.27; 14 13.02,3.81; 15 13.02,6.35; 16 13.02,8.89 | hole 1.4: -11.914,-10.541; 11.286,-10.541
CRYSTAL-SMD-2X2.5MM = smd 1.2 x 1.1: P1 0.846,0.69; P2 -0.854,0.69; P3 -0.854,-0.71; P4 0.846,-0.71

### Placement (x,y rotation side)
C1  11.18,25.65 0 top
C2  15.79,50.04 270 top
C3  15.24,52.45 0 top
C4  15.24,36.2 180 bottom
C5  9.27,42.29 180 top
C7  14.61,28.07 180 top
C8  16.13,22.1 90 top
C9  19.05,22.61 180 top
C10  18.67,26.16 270 top
C16  9.27,46.61 0 top
C17  9.27,40.42 180 top
C18  22.86,43.62 0 top
C20  22.86,40.18 0 top
C21  22.86,46.19 0 top
C22  18.54,49.91 90 top
C23  14.86,50.04 90 top
C24  22.86,47.88 0 top
C25  22.86,45.28 0 top
C26  9.27,39.5 180 top
C27  15.57,38.48 270 top
C28  22.86,41.1 0 top
C29  15.24,37.21 180 bottom
D1  15.24,30.48 0 top
D2  19.05,16.51 270 top
D3  22.86,6.35 0 top
D4  15.37,33.02 180 top
FD1  4.95,0.89 0 top
FD2  29.21,86.36 0 top
FD3  4.95,0.89 0 bottom
FD4  29.21,86.36 0 bottom
FRAME1  -17.14,-19.05 0 top  (outside the outline)
H1  2.54,88.9 0 top
H2  27.94,88.9 0 top
H3  27.94,2.54 0 top
H4  2.54,2.54 0 top
J1  10.16,34.29 270 top
J3  8.89,9.4 270 top
J4  7.37,18.03 90 top
J5  15.24,6.35 0 top
J6  9.78,38.35 0 bottom
J7  25.4,13.97 90 top
J8  5.08,24.13 90 top
JP1  12.06,9.53 270 bottom
Q1  16.13,16.51 90 top
R1  9.78,3.43 90 top
R2  14.61,28.98 0 top
R3  12.83,33.53 270 top
R4  20.7,3.43 90 top
R5  17.5,28.61 180 bottom
R6  12.95,25.02 270 top
R7  22.86,42.71 180 top
R8  25.4,6.35 270 top
R9  17.5,29.54 180 bottom
R10  13.97,7.62 90 bottom
R11  9.27,41.36 0 top
R12  19.48,36.96 90 bottom
R13  20.42,36.96 90 bottom
R15  18.03,14.22 180 top
R16  16.13,20.07 90 top
R17  13.97,11.43 270 bottom
S1  15.24,10.16 0 top
S2  22.86,10.16 180 top
S3  -27.94,-24.13 0 top  (outside the outline)
TP1  6.35,30.48 0 bottom
TP2  8.89,30.48 0 bottom
TP3  11.43,30.48 0 bottom
U2  11.18,27.94 0 top
U3  15.75,25.65 90 top
U4  15.37,32.89 0 bottom
U5  15.88,43.31 270 top
U6  15.24,54.61 0 top
U7  19.05,20.32 270 top
U$1  [#_16#0]  5.46,31.75 0 top
U$2  [#_17#0]  5.46,34.29 0 top
U$3  [#_18#0]  5.46,36.83 0 top
U$4  [#_19#0]  5.46,39.37 0 top
U$5  [#_20#0]  5.46,41.91 0 top
U$6  [#_21#0]  5.46,44.45 0 top
U$7  [#_22#0]  5.46,46.99 0 top
U$8  [#_SCL#7#23#0]  5.46,49.53 0 top
U$9  [#_SDA#6#0]  5.46,52.07 0 top
U$10  [#WS2812_#0]  25.02,52.07 0 top
U$11  [#0#TX_#0]  25.02,49.53 0 top
U$12  [#1#RX_#0]  25.02,46.99 0 top
U$13  [#4#CIPO_#0]  25.02,44.45 0 top
U$14  [#3#COPI_#0]  25.02,41.91 0 top
U$15  [#2#SCK_#0]  25.02,39.37 0 top
U$16  [PWR0]  22.86,5.08 0 top
U$17  [#I�C#0]  10.44,9.53 90 bottom
U$18  [#29#ADC3_#0]  25.02,31.75 0 top
U$19  [#28#ADC2_#0]  25.02,29.21 0 top
U$20  [#27#ADC1_#0]  25.02,26.67 0 top
U$21  [#26#ADC0_#0]  25.02,24.13 0 top
U$22  [#_VUSB#0]  5.46,29.21 0 top
U$23  [#_EN#0]  5.46,26.67 0 top
U$24  [#_VBATT#0]  5.46,24.13 0 top
U$25  [#GND_#0]  25.02,21.59 0 top
U$26  [#AREF_#0]  25.02,19.05 0 top
U$27  [#3#3V_#0]  25.02,16.51 0 top
U$28  [##RESET##0]  24.89,13.97 0 top
U$29  [RP2040_10]  20.19,33.27 0 top
U$30  [RP2040_20]  9.65,14.48 0 bottom
U$31  [ORDERING_INSTRUCTIONS]  46.99,57.15 0 top  (outside the outline)
U$32  [SFE_LOGO_NAME_FLAME_.1]  12.83,18.92 0 bottom
U$33  [#SCL_#0]  5.46,49.53 0 bottom
U$34  [#SDA_#0]  5.46,52.07 0 bottom
U$35  [#_#RESET##0]  25.02,13.97 0 bottom
U$36  [#_3#3V#0]  25.02,16.51 0 bottom
U$37  [#_AREF#0]  25.02,19.05 0 bottom
U$38  [#_GND#0]  25.02,21.59 0 bottom
U$39  [#_26#ADC0#0]  25.02,24.13 0 bottom
U$40  [#_27#ADC1#0]  25.02,26.67 0 bottom
U$41  [#_28#ADC2#0]  25.02,29.21 0 bottom
U$42  [#_29#ADC3#0]  25.02,31.75 0 bottom
U$43  15.24,71.12 0 top
U$44  [THING_PLUS0]  10.16,17.14 0 bottom
U$45  [SFE_LOGO_NAME_.1]  18.16,36.55 0 top
U$47  [THING_PLUS_0]  20.19,34.92 0 top
U$54  [250]  15.24,34.29 0 top
U$55  [CHARGE0]  15.24,31.75 0 top
U$56  [BOOT0]  15.24,13.97 0 top
U$57  [#22_#0]  5.46,46.99 0 bottom
U$58  [#21_#0]  5.46,44.45 0 bottom
U$59  [#20_#0]  5.46,41.91 0 bottom
U$60  [#WS2812#0]  10.67,54.74 0 top
U$61  [#19_#0]  5.46,39.37 0 bottom
U$62  [#18_#0]  5.46,36.83 0 bottom
U$63  [#17_#0]  5.46,34.29 0 bottom
U$64  [QWIIC_4MM]  10.54,9.4 270 top
U$65  [#16_#0]  5.46,31.75 0 bottom
U$66  [#VUSB_#0]  5.46,29.21 0 bottom
U$67  [#EN_#0]  5.46,26.67 0 bottom
U$68  [#VBATT_#0]  5.46,24.13 0 bottom
U$69  [#_NC#0]  25.02,34.29 0 bottom
U$70  [#_NC#0]  25.02,36.83 0 bottom
Y2  9.27,44.45 270 top

### Tracks (layer width: path | path; a pad name or v marks a point on that pad's centre or on a via)
1.1V  (via drill 0.2 pad 0.45)
  Top 0.127: C26.1 | C25.1 | C24.1 22.31,47.88
  Top 0.203: C25.1 22.35,44.6 20.68,42.93 20.68,42.01 20.17,41.51 U5.45 18.77,41.51 18.54,41.27 18.29,41.27 17.91,41.66 17.91,42.55 v18.41,43.05 18.87,43.51 U5.50 20.29,43.51 21.43,44.65 21.43,47 22.31,47.88 | v13.34,42.93 13.12,42.71 U5.23 11.72,42.71 11.51,42.49 11.51,41.5 10.96,40.95 10.96,40.67 C26.1
  pwrhorz 0.203: v18.41,43.05 18.29,42.93 v13.34,42.93
3.3V  (via drill 0.2 pad 0.45)  (15 unrouted)
  Top 0.127: C17.1 9.84,40.42 | C22.1 18.48,49.34 | J3.2 7.37,9.9 v7.37,9.91 | 20.64,21.27 U7.5 | C3.1 14.32,52.87 v14.32,53.21 U6.4 | C18.1 R7.2 | v16.54,50.54 v16.55,50.53 | D3.A 20.83,6.35 v20.7,6.48
  Top 0.203: C23.1 14.88,49.51 v14.88,47.88 14.88,46.75 U5.10 | U5.49 20.02,43.11 | 20.02,43.11 20.37,43.11 21.83,44.56 21.83,45.67 C21.1 | U5.22 11.61,43.11 11.18,42.67 11.18,41.71 v10.49,41.02 10.44,41.02 9.84,40.42 | U5.1 v18.48,47.88 18.48,49.34 | U5.33 14.88,38.98 | 14.88,38.98 v14.88,38.48 | U5.44 20.43,41.11 21.18,41.86 21.18,42.52 v21.2,42.53 22.29,43.62 C18.1 | C20.1 21.01,40.18 20.69,39.87 v20.45,39.87 U5.42 | C2.1 v16.54,50.54 | U5.48 20,42.71 | 20,42.71 v20.21,42.49 | C21.1 | C21.1 v22.35,46.98 | 20,42.71 20.02,42.73 20.02,43.11 | C27.1 14.88,38.98
  Top 0.305: U7.5 20.35,21.81 C9.1 | J7.2 v21.59,20.32 20.64,21.27
  Bottom 0.127: JP1.2 v13.46,9.53 | U4.8 12.59,36.09 v12.7,36.2 C4.1 C29.1 | R9.2 v18.64,29.54
  Bottom 0.203: v14.88,47.88 15.24,47.88 15.42,48.06 J6.VCC 15.42,50.34 15.61,50.53 v16.55,50.53
  pour pwrhorz: 0,91.44 30.48,91.44 30.48,0 0,0
!RESET!  (via drill 0.2 pad 0.45)
  Top 0.127: J7.1 25.65,13.72 S2.3 | U5.26 13.45,41.51 13.56,41.62 v13.61,41.62
  gndvert 0.127: v12.7,13.97 12.7,29.84 J1.10 11.39,32.35 11.39,32.43 13.31,34.35 13.31,41.32 v13.61,41.62
  pwrhorz 0.127: J7.1 v12.7,13.97
  Bottom 0.127: J1.10 11.43,31.11 TP3.P$1
ADC0  (1 unrouted)
  Top 0.127: U5.38 16.86,39.85 16.86,36.25 18.56,34.54 22.37,34.54 22.86,34.06 22.86,26.67 J7.5
ADC1
  Top 0.127: U5.39 17.27,36.19 18.67,34.8 22.48,34.8 23.24,34.04 23.24,28.83 J7.6
ADC2
  Top 0.127: U5.40 17.68,39.22 18.54,38.35 22.86,38.35 23.62,37.59 23.62,30.99 J7.7
ADC3
  Top 0.127: U5.41 18.07,39.2 18.67,38.61 22.99,38.61 23.88,37.72 23.88,33.27 J7.8
AVDD  (via drill 0.2 pad 0.45)
  Top 0.127: U5.43 21.15,40.71 21.54,41.1 C28.1 22.36,41.41 23.36,42.41 R7.1 24.09,42.71 v24.12,42.74
  gndvert 0.127: v24.12,42.74 23.75,42.37 23.75,20.7 J7.3
BATT_ALERT
  Top 0.127: U5.36 16.07,36.14 15.24,35.31 15.24,32.13 14.73,31.62 12.7,31.62 12.05,30.98 12.05,29.06 U2.5
BOOT  (via drill 0.2 pad 0.45)
  Top 0.127: v14.96,8.38 14.83,8.26 S1.3
  gndvert 0.127: v19.81,9.4 19.93,9.51 19.93,27.81 19.14,28.6 v18.64,28.6
  pwrhorz 0.127: v14.96,8.38 18.8,8.38 v19.81,9.4
  Bottom 0.127: v18.64,28.6 18.01,28.6 R5.2
EN  (via drill 0.2 pad 0.45)
  Top 0.127: U7.3 v16.76,19.37 16.32,19.37 R16.1
  Bottom 0.127: J8.2 7.62,24.13 7.62,21.59 9.65,19.56 16.58,19.56 v16.76,19.37
GND  (via drill 0.2 pad 0.45)  (101 unrouted)
  Top 0.254: U2.4 11.93,25.9 C1.2
  other vias: 10.41,42.29 17.02,41.02 13.34,43.56 11.43,46.48 22.86,49.53 24.38,45.72 19.43,39.24 22.86,39.37 13.87,36.78 23.34,47.04 24.26,43.46 16.69,52.45 17.2,55.17 7.87,40.03 11.4,44.75 24.23,41.12 18.16,24.79 23.11,35.71 18.16,36.98 8.64,34.95 11.81,24.92 11.18,27.94 18.92,20.35 16.76,20.35 18.54,18.57 7.87,46.61 9.78,28.19 17.4,22.63 18.54,13.36 7.37,10.95 6.48,10.95 7.37,11.84 7.87,17.04 7.87,17.81 7.87,16.28 11.3,6.88 18.41,7.26 8.76,4.09 21.72,3.96 20.7,4.98 9.78,5.23 13.21,28.19 14.61,42.04 14.61,44.45 17.14,43.94 17.14,42.04 15.75,42.04 15.75,43.43 15.75,44.58
  pour gndvert: 0,91.44 30.48,91.44 30.48,0 0,0
  pour Bottom: 0,91.44 30.48,91.44 30.48,0 0,0
  pour Top: 0,91.44 30.48,91.44 30.48,0 0,0
GPIO16  (via drill 0.2 pad 0.45)
  Top 0.127: U5.27 11.91,41.11 11.59,40.79 11.59,40.04 v11.43,39.88 | v8.13,33.02 6.86,31.75 J8.4
  gndvert 0.127: v11.43,39.88 9.53,39.88 8.13,38.48 v8.13,33.02
GPIO17  (via drill 0.2 pad 0.45)
  Top 0.127: U5.28 12.44,40.56 v12.06,40.19 | v7.62,35.56 6.35,34.29 J8.5
  gndvert 0.127: v12.06,40.19 11.87,40.39 9.4,40.39 7.62,38.61 v7.62,35.56
GPIO18  (via drill 0.2 pad 0.45)
  Top 0.127: U5.29 13.28,39.18 v14.1,38.35
  pwrhorz 0.127: v14.1,38.35 13.72,38.73 6.99,38.73 J8.6
GPIO19  (via drill 0.2 pad 0.45)
  Top 0.127: U5.30 13.68,39.41 v14.1,38.99
  pwrhorz 0.127: v14.1,38.99 5.46,38.99 J8.7
GPIO20  (via drill 0.2 pad 0.45)
  Top 0.127: U5.31 14.06,39.89 v14.06,40.66 | v7.87,40.64 6.35,40.64 J8.8
  pwrhorz 0.127: v14.06,40.66 7.89,40.66 v7.87,40.64
GPIO21  (via drill 0.2 pad 0.45)
  Top 0.127: U5.32 14.47,40.48 v14.86,40.86
  pwrhorz 0.127: v14.86,40.86 14.7,41.02 12.85,41.02 11.07,42.8 6.73,42.8 J8.9
GPIO22  (via drill 0.2 pad 0.45)
  Top 0.127: U5.34 15.28,41.06 v15.49,41.27
  pwrhorz 0.127: v15.49,41.27 12.95,41.27 11.18,43.05 6.86,43.05 6.6,43.31 6.6,45.47 J8.10
I2C1_SCL/GPIO23  (via drill 0.2 pad 0.45)  (1 unrouted)
  Top 0.127: v7.37,7.87 8.87,7.87 J3.4 | U2.7 v10.93,29.71 v10.92,29.72 | U5.35 15.68,40.57 v16.13,41.02 | v15.66,45.81 15.28,46.19 U5.9
  gndvert 0.127: v7.37,7.87 9.65,7.87 10.72,8.94 10.72,29.52 v10.92,29.72 10.03,30.61 8.13,30.61 6.99,31.75 6.99,48.01 v7.49,48.51 | v16.13,41.02 16.13,45.34 v15.66,45.81
  pwrhorz 0.127: v15.66,45.81 10.2,45.81 v7.49,48.51 6.48,49.53 J8.11
  Bottom 0.127: v7.37,7.87 13.22,7.87 R10.1
I2C1_SDA  (via drill 0.2 pad 0.45)  (1 unrouted)
  Top 0.127: v7.37,8.89 v7.37,8.9 J3.3 | U2.8 10.43,29.45 v10.16,29.72 | U5.8 15.68,47.55 v16,47.88
  gndvert 0.127: v7.37,8.89 9.02,8.89 10.16,10.03 v10.16,29.72 9.53,30.35 8,30.35 6.73,31.62 6.73,50.67 5.33,52.07 J8.12
  pwrhorz 0.127: v16,47.88 11.81,52.07 J8.12
  Bottom 0.127: v7.37,8.89 J3.3 11.93,11.93 R17.1
LED_BUILTIN
  Top 0.127: U5.37 16.48,36.16 16.24,35.93 D4.A
MIK_RST  (1 unrouted)
N$1
  Top 0.127: D4.C R3.2
N$2
  Bottom 0.127: JP1.3 13.61,8.48 R10.2
N$3
  Bottom 0.127: JP1.1 13.61,10.57 R17.2
N$4
  Top 0.127: R11.2 9.87,41.47 10.45,41.47 10.87,41.88 10.87,42.88 11.5,43.51 U5.21
N$5
  Top 0.127: Y2.P3 8.56,45.32 9.77,46.53 C16.2 10.54,46.61 10.79,46.35 10.79,44.2 11.08,43.91 U5.20
N$6
  Top 0.127: Y2.P1 9.96,43.48 C5.2 R11.1
N$7
  Top 0.127: R8.2 24.9,6.35 D3.C
N$9
  Top 0.127: D1.C 16.12,24.9 16.32,24.7 U3.1
N$11
  Top 0.127: J5.A5 13.99,4.34 12.58,2.93 R1.1
N$12
  Top 0.127: R4.1 18.41,2.93 16.99,4.35 J5.B5
N$14
  Top 0.254: U3.5 13.49,24.7 R6.2
N$15
  Top 0.127: 16.2,21.27 16.13,21.34 | Q1.2 17.33,17.66 D2.C
  Top 0.305: C8.1 16.13,21.34 R16.2 | 16.2,21.27 U7.1 18.73,21.27 19.43,20.57 19.43,17.66 D2.C
N$17
  Top 0.127: R2.1 14.11,30.22 D1.A
QSPI-0  (via drill 0.2 pad 0.45)
  Top 0.127: U5.53 19.94,44.71 20.46,45.23 20.46,47.66 20.83,48.03 v20.83,49.15
  gndvert 0.127: v20.83,49.15 20.83,46.56 21.6,45.79 21.6,31.87 v22.35,31.11
  pwrhorz 0.127: v22.35,31.11 12.19,31.11 v11.81,31.5
  Bottom 0.127: v11.81,31.5 12.32,30.99 U4.5
QSPI-1  (via drill 0.2 pad 0.45)
  Top 0.127: U5.55 19.84,45.51 19.94,45.6 v19.94,49.15
  gndvert 0.127: v20.83,32.89 20.83,41.36 19.79,42.39 19.79,42.7 19.94,42.84 v19.94,49.15
  pwrhorz 0.127: v20.83,32.89 v18.92,32.89
  Bottom 0.127: v18.92,32.89 18.29,33.53 U4.2
QSPI-2  (via drill 0.2 pad 0.45)
  Top 0.127: U5.54 19.9,45.11 20.21,45.41 20.21,47.82 20.41,48.02 v20.41,48.64
  gndvert 0.127: v20.41,48.64 20.41,43.09 20.57,42.93 20.57,42.55 21.35,41.77 21.35,32.02 v20.95,31.62
  pwrhorz 0.127: v20.95,31.62 v18.92,31.62
  Bottom 0.127: v18.92,31.62 18.29,32.26 U4.3
QSPI-3  (via drill 0.2 pad 0.45)
  Top 0.127: v21.84,49.15 21.84,48.18 21.07,47.41 21.07,44.98 20,43.91 U5.51
  gndvert 0.127: v21.84,49.15 21.84,46.41 22.21,46.04 22.21,33.76 v22.45,33.53
  pwrhorz 0.127: v22.45,33.53 v11.81,33.53
  Bottom 0.127: v11.81,33.53 U4.7
QSPI-CLK  (via drill 0.2 pad 0.45)
  Top 0.127: U5.52 19.97,44.31 20.77,45.11 20.77,47.54 21.38,48.15 v21.38,48.73
  gndvert 0.127: v21.38,48.73 21.38,46.44 21.91,45.91 21.91,32.7 v22.35,32.26
  pwrhorz 0.127: v22.35,32.26 v11.81,32.26
  Bottom 0.127: v11.81,32.26 U4.6
QSPI-CS  (via drill 0.2 pad 0.45)
  Top 0.127: U5.56 19.31,48.48 v19.47,48.64
  gndvert 0.127: v19.47,48.64 19.47,39.72 19.8,39.4 19.8,37.7 v18.16,36.07
  Bottom 0.127: R5.1 R9.1 17.02,29.56 17.02,34.54 17.27,34.8 U4.1 18.16,34.82 v18.16,36.07
SDIO_DAT1  (via drill 0.2 pad 0.45)
  Top 0.127: U5.14 13.28,47.18 v12.95,47.5
  Bottom 0.127: v12.95,47.5 12.7,47.24 11.56,47.24 11.02,47.78 J6.DAT1
SDIO_DAT2  (via drill 0.2 pad 0.45)
  Top 0.127: U5.13 13.68,47.28 13.46,47.5 v13.46,51.44
  pwrhorz 0.127: v13.46,51.44 v18.67,51.44
  Bottom 0.127: v18.67,51.44 18.67,49.1 J6.DAT2
SPI0_CIPO  (via drill 0.2 pad 0.45)  (1 unrouted)
  Top 0.127: v16.38,45.72 16.48,45.81 U5.6
  Bottom 0.127: v16.38,45.72 16.43,45.67 16.43,45.34 17.32,44.45 J7.13
SPI0_COPI  (via drill 0.2 pad 0.45)  (1 unrouted)
  Top 0.127: U5.5 16.88,45.48 v17.02,45.34
  pwrhorz 0.127: v17.02,45.34 17.27,45.34 18.43,44.18 20.95,44.18 23.22,41.91 J7.12
SPI0_SCK  (via drill 0.2 pad 0.45)  (1 unrouted)
  Top 0.127: v18.41,43.81 17.78,44.45 17.78,45.34 17.27,45.85 U5.4
  pwrhorz 0.127: J7.11 20.95,43.81 v18.41,43.81
SPI_!CS1!/SDIO_DAT3  (via drill 0.2 pad 0.45)
  Top 0.127: U5.12 14.07,47.54 13.97,47.65 13.97,51.56 v13.46,52.07
  pwrhorz 0.127: v13.46,52.07 v17.4,52.07
  Bottom 0.127: v17.4,52.07 17.62,51.85 J6.CS/DAT3
SPI_CIPO1/SDIO_DAT0  (via drill 0.2 pad 0.45)
  Top 0.127: U5.15 12.44,47.63 v12.19,47.88
  Bottom 0.127: v12.19,47.88 12.12,47.95 J6.DO/DAT0
SPI_COPI1/SDIO_CMD  (via drill 0.2 pad 0.45)
  Top 0.127: U5.18 13.19,44.71 v13.21,44.69
  Bottom 0.127: v13.21,44.69 13.65,44.69 13.67,44.67 14.19,44.67 14.61,45.09 14.61,45.72 16.52,47.63 J6.DI/CMD
SPI_SCK1/SDIO_CLK  (via drill 0.2 pad 0.45)
  Top 0.127: U5.17 13.82,45.11 v13.84,45.09
  Bottom 0.127: v13.84,45.09 14.32,45.56 J6.SCLK
SWDCK  (via drill 0.2 pad 0.45)
  Top 0.127: U5.24 13.32,42.31 v13.34,42.29
  Bottom 0.127: 12.51,37.27 13.32,38.09 13.32,41.32 13.17,41.48 13.17,41.76 13.34,41.92 v13.34,42.29 | 12.51,37.27 J1.4 | TP1.P$1 6.35,37.85 7.24,38.73 10.02,38.73 10.86,37.89 11.89,37.89 12.51,37.27
SWDIO
  Top 0.127: U5.25 11.91,41.91 11.81,41.81 11.81,41.37 11.34,40.9 11.34,40.57 10.79,40.03 J1.2
  Bottom 0.127: TP2.P$1 8.76,30.48 6.86,32.38 6.86,37.08 7.75,37.97 9.65,37.97 J1.2
UART0_RX  (via drill 0.2 pad 0.45)  (1 unrouted)
  Top 0.127: v18.29,45.3 18.13,45.47 18.12,45.47 17.68,45.91 U5.3
  Bottom 0.127: J7.14 24,48.39 22.35,48.39 19.27,45.3 v18.29,45.3
UART0_TX  (via drill 0.2 pad 0.45)  (1 unrouted)
  Top 0.127: v18.29,45.88 18.07,46.09 U5.2
  Bottom 0.127: J7.15 24.51,48.64 22.25,48.64 19.49,45.88 v18.29,45.88
USB_F_N  (via drill 0.2 pad 0.45)
  Top 0.127: v18.41,41.82 18.5,41.91 U5.46
  Bottom 0.127: R12.2 19.48,37.94 18.64,38.78 18.64,41.59 v18.41,41.82
USB_F_P  (via drill 0.2 pad 0.45)
  Top 0.127: v18.41,42.4 18.5,42.31 U5.47
  Bottom 0.127: R13.2 20.42,37.91 19.91,38.42 19.36,38.42 18.89,38.89 18.89,41.93 18.43,42.4 v18.41,42.4
USB_N  (via drill 0.2 pad 0.45)
  Top 0.127: J5.B7 14.49,6.74 14.61,6.86 15.49,6.86 | v16.51,8.98 15.49,7.96 15.49,7.37 15.49,7.36 15.49,6.86 | J5.A7 15.49,6.86
  Bottom 0.127: R12.1 19.52,36.41 19.52,30.31 19.56,30.27 19.56,12.03 v16.51,8.98
USB_P  (via drill 0.2 pad 0.45)
  Top 0.127: J5.A6 14.99,5.33 15.11,5.21 15.88,5.21 16,5.33 16,6 J5.B6 15.99,7.08 15.92,7.14 15.92,7.7 v15.9,7.72
  Bottom 0.127: v15.9,7.72 20.32,12.14 20.32,30.27 20.36,30.31 20.36,36.39 R13.1
V_BATT  (via drill 0.2 pad 0.45)
  Top 0.127: 10.93,25.9 C1.1 10.68,24.13 | 10.68,19.42 J4.2
  Top 0.254: U3.3 17.11,26.66 | 17.05,27.4 v17.02,27.43
  Top 0.305: U2.2 10.93,26.29 | 10.93,26.29 10.93,25.9 | J8.1 10.68,24.13 | J4.2 14.37,19.03 15.03,18.37 Q1.3 | 10.68,19.42 C1.1 10.29,25.65 v9.4,26.54 | 17.11,26.66 C10.1 | U3.3 17.05,27.4 | U2.3 11.43,26.42 11.3,26.29 10.93,26.29
  pwrhorz 0.305: v17.02,27.43 16.76,27.69 12.05,27.69 10.91,26.54 v9.4,26.54
V_USB  (via drill 0.2 pad 0.45)  (1 unrouted)
  Top 0.254: U3.4 14.19,26.6 | 17.69,7.2 v17.65,7.24 | R15.2
  Top 0.305: Q1.1 18.85,15.56 D2.A | R15.2 17.45,14.22 17.13,14.54 Q1.1 | R2.2 C7.1 15.11,26.61 15.11,26.6 | Q1.1 16.13,16.56 16.13,17.91 14.48,19.56 14.48,22.86 15.62,24 15.62,26.29 15.31,26.6 15.11,26.6 | 14.19,26.6 13.62,27.18 v13.34,27.18 | J5.VBUS2 17.69,7.2 | v17.53,13.34 R15.2 | J5.VBUS1 12.79,7.2 v12.83,7.24 | U3.4 15.11,26.6
  gndvert 0.254: 17.65,13.21 v17.53,13.34
  gndvert 0.305: v17.65,7.24 17.65,13.21
  pwrhorz 0.305: v12.83,7.24 12.83,7.11 17.53,7.11 v17.65,7.24
  Bottom 0.305: v13.34,27.18 7.11,27.18 J8.3
WS2812_DI
  Top 0.127: U5.11 14.47,47.5 14.22,47.75 14.22,52.61 13.78,53.05 13.78,54.62 U6.3
WS2812_DO
  Top 0.127: U6.1 18.14,52.07 J7.16

### Text on the board
Bottom: v11
tPlace: + | -
Measures: Units in inches
tDocu: Four Layer | 1.6mm FR4 | N. Poole